# EAGLE schematic board (EAGLE 6.4)
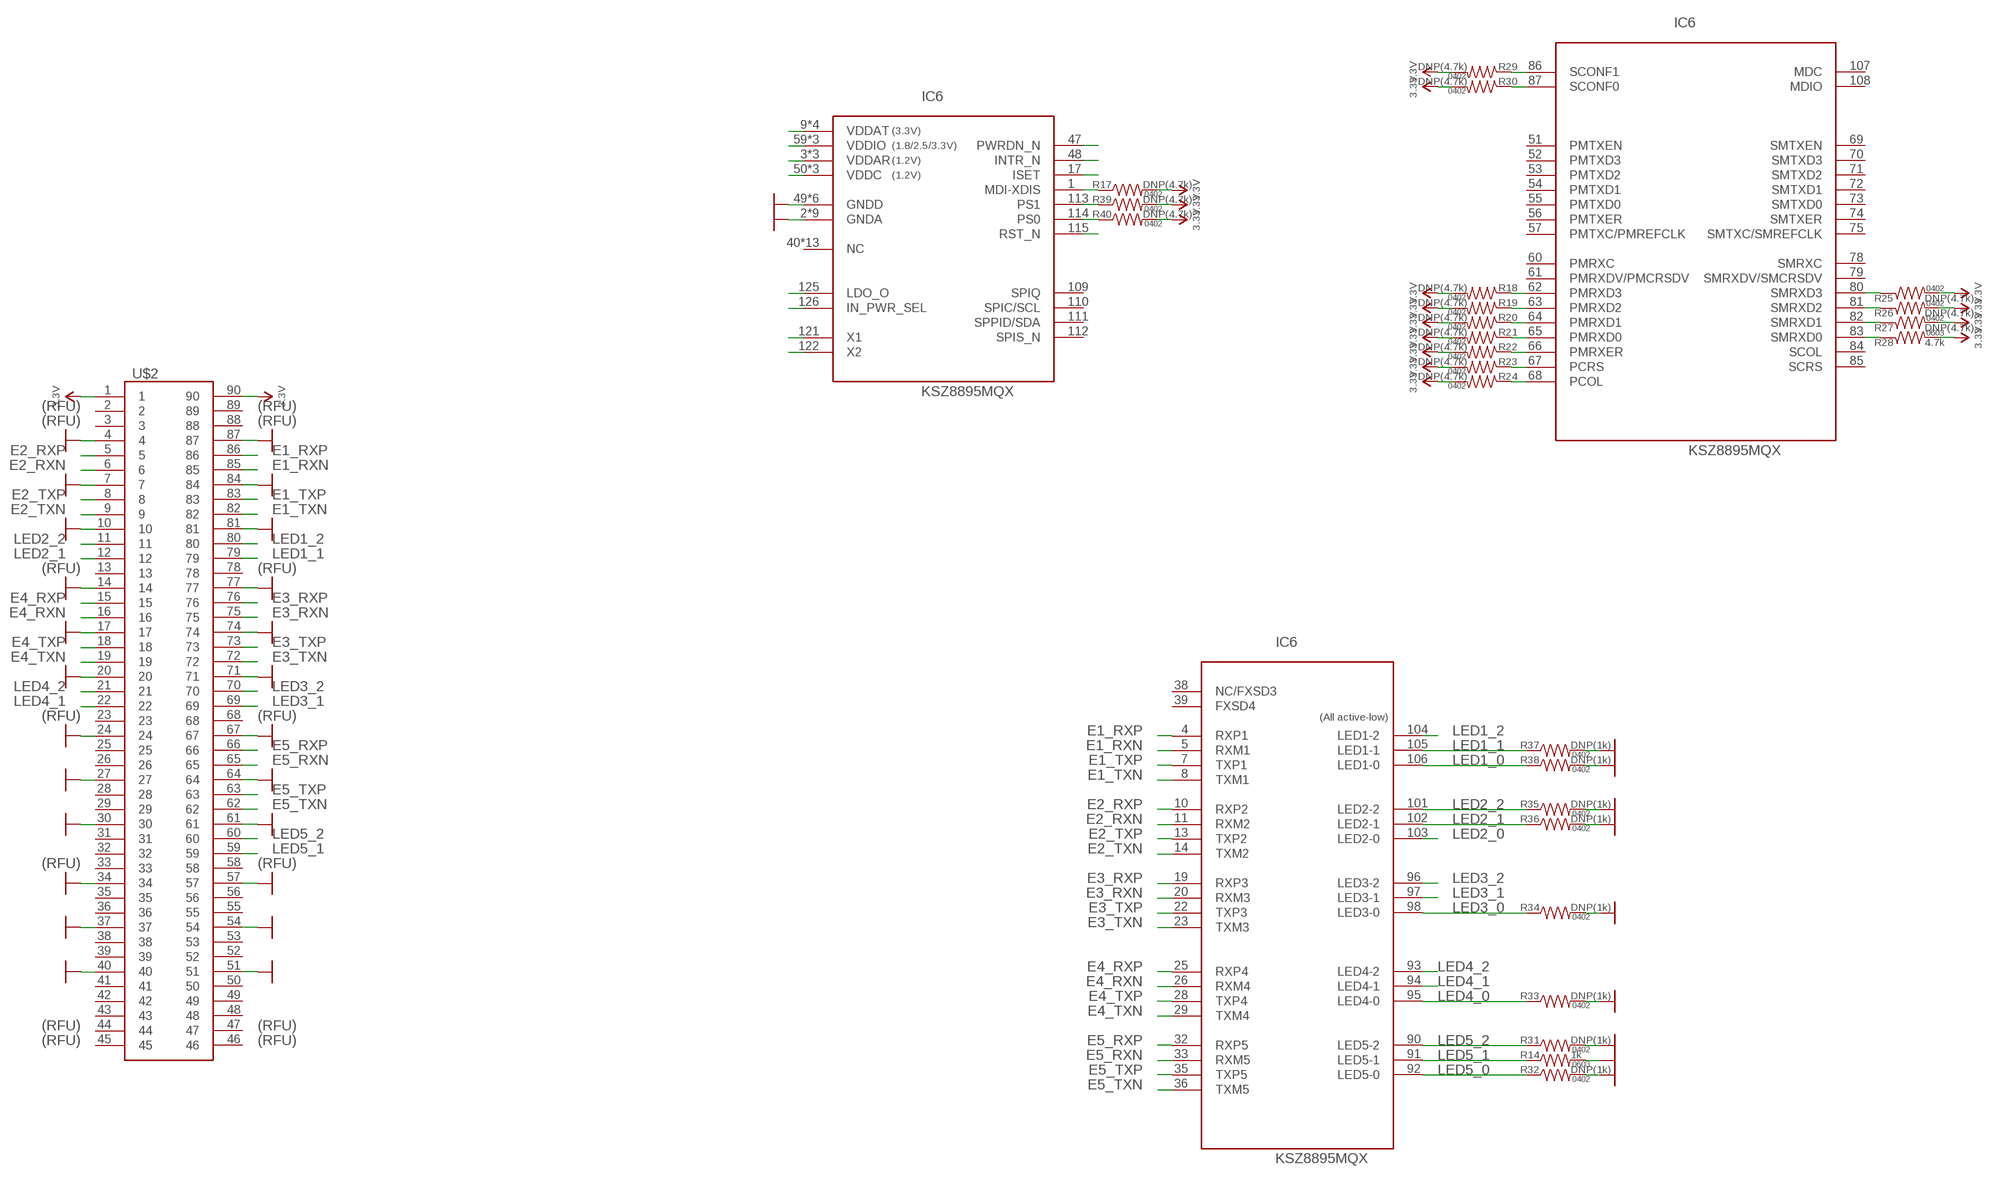
[diagram p0: schematic, sheet 1]

## Parts
IC6  KSZ8895MQX  KSZ8895  [PQFP-128]
R14  1k  RESISTOR0603  [0603-RES]
R17  DNP(4.7k)  RESISTOR0402  [0402-RES]
R18  DNP(4.7k)  RESISTOR0402  [0402-RES]
R19  DNP(4.7k)  RESISTOR0402  [0402-RES]
R20  DNP(4.7k)  RESISTOR0402  [0402-RES]
R21  DNP(4.7k)  RESISTOR0402  [0402-RES]
R22  DNP(4.7k)  RESISTOR0402  [0402-RES]
R23  DNP(4.7k)  RESISTOR0402  [0402-RES]
R24  DNP(4.7k)  RESISTOR0402  [0402-RES]
R25  DNP(4.7k)  RESISTOR0402  [0402-RES]
R26  DNP(4.7k)  RESISTOR0402  [0402-RES]
R27  DNP(4.7k)  RESISTOR0402  [0402-RES]
R28  4.7k  RESISTOR0603  [0603-RES]
R29  DNP(4.7k)  RESISTOR0402  [0402-RES]
R30  DNP(4.7k)  RESISTOR0402  [0402-RES]
R31  DNP(1k)  RESISTOR0402  [0402-RES]
R32  DNP(1k)  RESISTOR0402  [0402-RES]
R33  DNP(1k)  RESISTOR0402  [0402-RES]
R34  DNP(1k)  RESISTOR0402  [0402-RES]
R35  DNP(1k)  RESISTOR0402  [0402-RES]
R36  DNP(1k)  RESISTOR0402  [0402-RES]
R37  DNP(1k)  RESISTOR0402  [0402-RES]
R38  DNP(1k)  RESISTOR0402  [0402-RES]
R39  DNP(4.7k)  RESISTOR0402  [0402-RES]
R40  DNP(4.7k)  RESISTOR0402  [0402-RES]
U$2  DF40-90HDR  [DF40-HDR-90]

## Nets
3.3V: R17.2 R18.2 R19.2 R20.2 R21.2 R22.2 R23.2 R24.2 R25.2 R26.2 R27.2 R28.2 R29.2 R30.2 R39.2 R40.2 U$2.1 U$2.90
E1_RXN: IC6.5(RXM1) U$2.85
E1_RXP: IC6.4(RXP1) U$2.86
E1_TXN: IC6.8(TXM1) U$2.82
E1_TXP: IC6.7(TXP1) U$2.83
E2_RXN: IC6.11(RXM2) U$2.6
E2_RXP: IC6.10(RXP2) U$2.5
E2_TXN: IC6.14(TXM2) U$2.9
E2_TXP: IC6.13(TXP2) U$2.8
E3_RXN: IC6.20(RXM3) U$2.75
E3_RXP: IC6.19(RXP3) U$2.76
E3_TXN: IC6.23(TXM3) U$2.72
E3_TXP: IC6.22(TXP3) U$2.73
E4_RXN: IC6.26(RXM4) U$2.16
E4_RXP: IC6.25(RXP4) U$2.15
E4_TXN: IC6.29(TXM4) U$2.19
E4_TXP: IC6.28(TXP4) U$2.18
E5_RXN: IC6.33(RXM5) U$2.65
E5_RXP: IC6.32(RXP5) U$2.66
E5_TXN: IC6.36(TXM5) U$2.62
E5_TXP: IC6.35(TXP5) U$2.63
GND: IC6.2(GNDA) IC6.6(GNDA) IC6.12(GNDA) IC6.16(GNDA) IC6.21(GNDA) IC6.27(GNDA) IC6.30(GNDA) IC6.34(GNDA) IC6.49(GNDD) IC6.58(GNDD) IC6.76(GNDD) IC6.88(GNDD) IC6.99(GNDD) IC6.116(GNDD) IC6.127(GNDA) R14.2 R31.2 R32.2 R33.2 R34.2 R35.2 R36.2 R37.2 R38.2 U$2.4 U$2.7 U$2.10 U$2.14 U$2.17 U$2.20 U$2.24 U$2.27 U$2.30 U$2.34 U$2.37 U$2.40 U$2.51 U$2.54 U$2.57 U$2.61 U$2.64 U$2.67 U$2.71 U$2.74 U$2.77 U$2.81 U$2.84 U$2.87
LED1_0: IC6.106(LED1-0) R38.1
LED1_1: IC6.105(LED1-1) R37.1 U$2.79
LED1_2: IC6.104(LED1-2) U$2.80
LED2_0: IC6.103(LED2-0)
LED2_1: IC6.102(LED2-1) R36.1 U$2.12
LED2_2: IC6.101(LED2-2) R35.1 U$2.11
LED3_0: IC6.98(LED3-0) R34.1
LED3_1: IC6.97(LED3-1) U$2.69
LED3_2: IC6.96(LED3-2) U$2.70
LED4_0: IC6.95(LED4-0) R33.1
LED4_1: IC6.94(LED4-1) U$2.22
LED4_2: IC6.93(LED4-2) U$2.21
LED5_0: IC6.92(LED5-0) R32.1
LED5_1: IC6.91(LED5-1) R14.1 U$2.59
LED5_2: IC6.90(LED5-2) R31.1 U$2.60
N$29: IC6.1(MDI-XDIS) R17.1
N$39: IC6.62(PMRXD3) R18.1
N$43: IC6.63(PMRXD2) R19.1
N$44: IC6.64(PMRXD1) R20.1
N$45: IC6.65(PMRXD0) R21.1
N$46: IC6.66(PMRXER) R22.1
N$47: IC6.67(PCRS) R23.1
N$48: IC6.68(PCOL) R24.1
N$49: IC6.80(SMRXD3) R25.1
N$50: IC6.81(SMRXD2) R26.1
N$51: IC6.82(SMRXD1) R27.1
N$52: IC6.83(SMRXD0) R28.1
N$53: IC6.86(SCONF1) R29.1
N$54: IC6.87(SCONF0) R30.1
N$62: IC6.113(PS1) R39.1
N$63: IC6.114(PS0) R40.1
N$64: IC6.115(RST_N)
N$65: IC6.17(ISET)
N$66: IC6.48(INTR_N)
N$67: IC6.47(PWRDN_N)
N$70: IC6.50(VDDC) IC6.89(VDDC) IC6.117(VDDC)
N$71: IC6.3(VDDAR) IC6.15(VDDAR) IC6.31(VDDAR)
N$72: IC6.59(VDDIO) IC6.77(VDDIO) IC6.100(VDDIO)
N$73: IC6.9(VDDAT) IC6.18(VDDAT) IC6.24(VDDAT) IC6.37(VDDAT)
N$74: IC6.125(LDO_O)
N$75: IC6.126(IN_PWR_SEL)
N$76: IC6.121(X1)
N$77: IC6.122(X2)
Unconnected: IC6.38(NC/FXSD3) IC6.39(FXSD4) IC6.40(NC) IC6.41(NC) IC6.42(NC) IC6.43(NC) IC6.44(NC) IC6.45(NC) IC6.46(NC) IC6.51(PMTXEN) IC6.52(PMTXD3) IC6.53(PMTXD2) IC6.54(PMTXD1) IC6.55(PMTXD0) IC6.56(PMTXER) IC6.57(PMTXC/PMREFCLK) IC6.60(PMRXC) IC6.61(PMRXDV/PMCRSDV) IC6.69(SMTXEN) IC6.70(SMTXD3) IC6.71(SMTXD2) IC6.72(SMTXD1) IC6.73(SMTXD0) IC6.74(SMTXER) IC6.75(SMTXC/SMREFCLK) IC6.78(SMRXC) IC6.79(SMRXDV/SMCRSDV) IC6.84(SCOL) IC6.85(SCRS) IC6.107(MDC) IC6.108(MDIO) IC6.109(SPIQ) IC6.110(SPIC/SCL) IC6.111(SPPID/SDA) IC6.112(SPIS_N) IC6.118(NC) IC6.119(NC) IC6.120(NC) IC6.123(NC) IC6.124(NC) IC6.128(NC) U$2.2 U$2.3 U$2.13 U$2.23 U$2.25 U$2.26 U$2.28 U$2.29 U$2.31 U$2.32 U$2.33 U$2.35 U$2.36 U$2.38 U$2.39 U$2.41 U$2.42 U$2.43 U$2.44 U$2.45 U$2.46 U$2.47 U$2.48 U$2.49 U$2.50 U$2.52 U$2.53 U$2.55 U$2.56 U$2.58 U$2.68 U$2.78 U$2.88 U$2.89

## Notes on the sheet
- (RFU) | (RFU)
- (RFU) | (RFU)
- (RFU) | (RFU)
- (RFU) | (RFU)
- (RFU) | (RFU)
- (RFU) | (RFU)
- (RFU) | (RFU)

## Library data of the parts
IC6 = kmod-testing:KSZ8895: Micrel KSZ8895 5-port ethernet switch Couple of different variants: MQ RQ FQ MQX RQX FQX ML ML has different package FQ/FQX have fiber rather than copper support MQ/RQ are now "legacy" products and are EOL at digikey That leaves MQX and RQX as the best options.
R14 R28 = kmod-passives:RESISTOR: Resistor Basic schematic elements and footprints for 0603, 1206, and PTH resistors.; PACKAGE: 0603
R17-R27 R29-R40 = kmod-passives:RESISTOR: Resistor Basic schematic elements and footprints for 0603, 1206, and PTH resistors.; PACKAGE: 0402
U$2 = kmod-connectors:DF40-90